# Altium schematic sheet cv_input.SchDoc
size A4; SheetNumber: 3; SheetTotal: 3
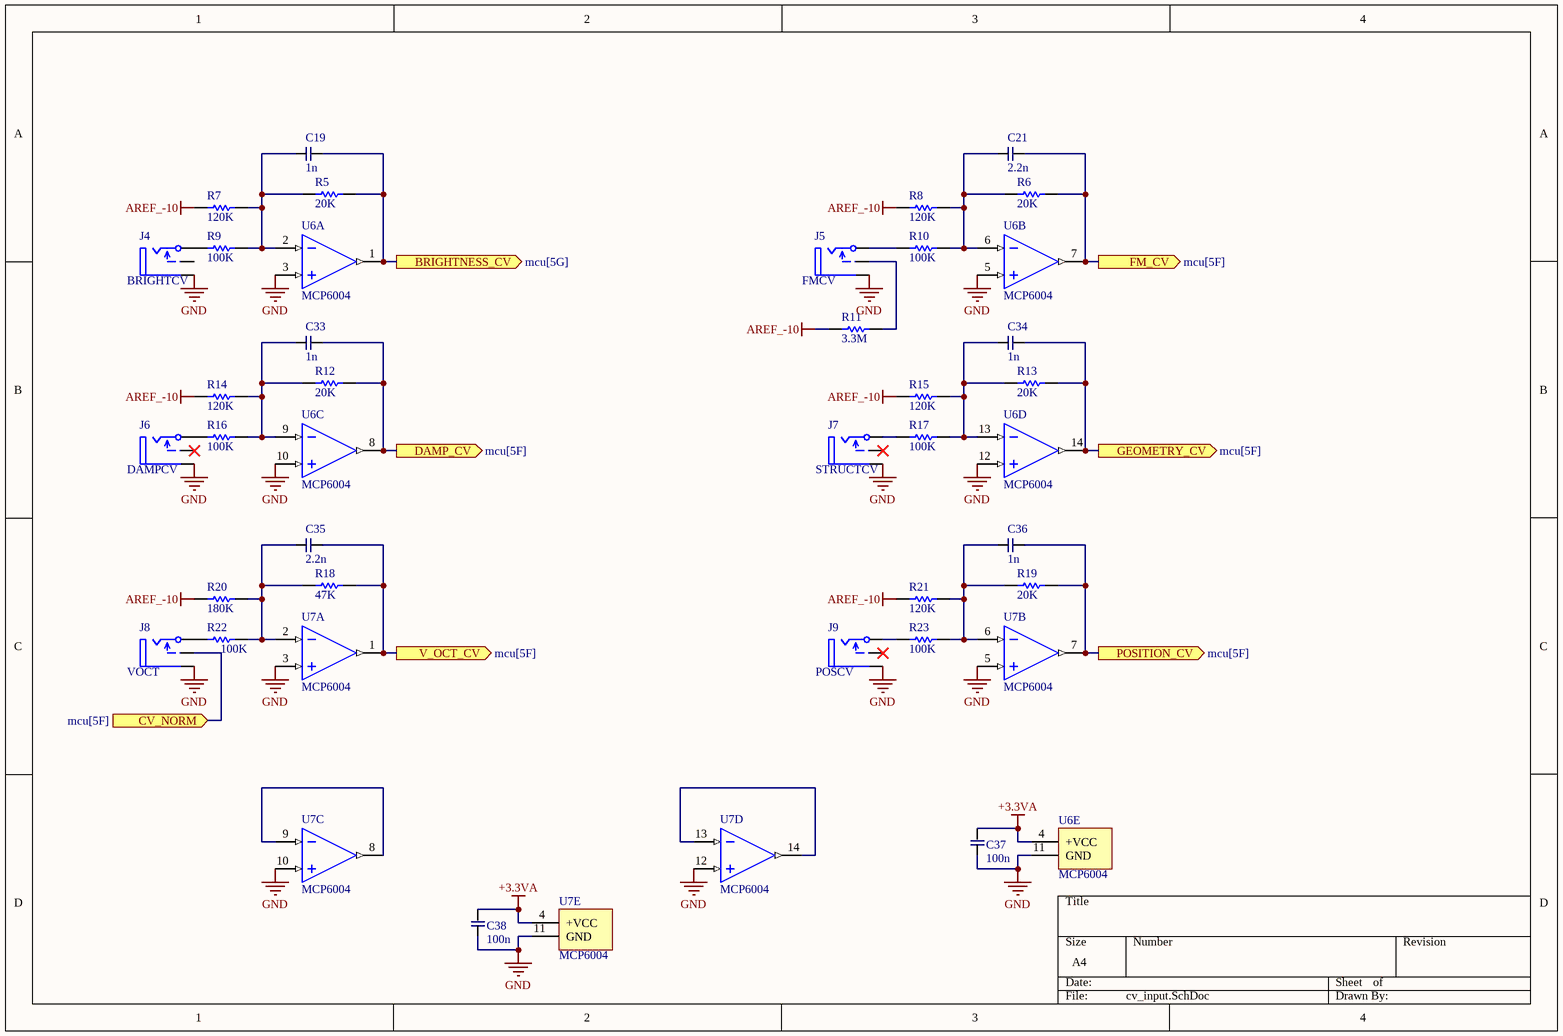
[diagram p0: cv_input.SchDoc]

## Parts
C19  value 1n  [C0603]  (hidden comment: Capacitor)
C21  value 2.2n  [C0603]  (hidden comment: Capacitor)
C33  value 1n  [C0603]  (hidden comment: Capacitor)
C34  value 1n  [C0603]  (hidden comment: Capacitor)
C35  value 2.2n  [C0603]  (hidden comment: Capacitor)
C36  value 1n  [C0603]  (hidden comment: Capacitor)
C37  value 100n  [C0603]  (hidden comment: Capacitor)
C38  value 100n  [C0603]  (hidden comment: Capacitor)
J4  BRIGHTCV  [PJ301_thonk]
J5  FMCV  [PJ301_thonk]
J6  DAMPCV  [PJ301_thonk]
J7  STRUCTCV  [PJ301_thonk]
J8  VOCT  [PJ301_thonk]
J9  POSCV  [PJ301_thonk]
R5  value 20K  [R0603]  (hidden comment: RESISTOR)
R6  value 20K  [R0603]  (hidden comment: RESISTOR)
R7  value 120K  [R0603]  (hidden comment: RESISTOR)
R8  value 120K  [R0603]  (hidden comment: RESISTOR)
R9  value 100K  [R0603]  (hidden comment: RESISTOR)
R10  value 100K  [R0603]  (hidden comment: RESISTOR)
R11  value 3.3M  [R0603]  (hidden comment: RESISTOR)
R12  value 20K  [R0603]  (hidden comment: RESISTOR)
R13  value 20K  [R0603]  (hidden comment: RESISTOR)
R14  value 120K  [R0603]  (hidden comment: RESISTOR)
R15  value 120K  [R0603]  (hidden comment: RESISTOR)
R16  value 100K  [R0603]  (hidden comment: RESISTOR)
R17  value 100K  [R0603]  (hidden comment: RESISTOR)
R18  value 47K  [R0603]  (hidden comment: RESISTOR)
R19  value 20K  [R0603]  (hidden comment: RESISTOR)
R20  value 180K  [R0603]  (hidden comment: RESISTOR)
R21  value 120K  [R0603]  (hidden comment: RESISTOR)
R22  value 100K  [R0603]  (hidden comment: RESISTOR)
R23  value 100K  [R0603]  (hidden comment: RESISTOR)
U6  MCP6004  [SOP14_L]  (parts A,B,C,D,E of 5)
U7  MCP6004  [SOP14_L]  (parts A,B,C,D,E of 5)

## Ports
BRIGHTNESS_CV (out, see mcu[5G]), CV_NORM (in, see mcu[5F]), DAMP_CV (out, see mcu[5F]), FM_CV (out, see mcu[5F]), GEOMETRY_CV (out, see mcu[5F]), POSITION_CV (out, see mcu[5F]), V_OCT_CV (out, see mcu[5F])

## Nets
+3.3VA: C37.2 C38.2 U6.4(+VCC) U7.4(+VCC)
AREF_-10: R7.1 R8.1 R11.1 R14.1 R15.1 R20.1 R21.1
GND: C37.1 C38.1 J4.1(Ground) J5.1(Ground) J6.1(Ground) J7.1(Ground) J8.1(Ground) J9.1(Ground) U6.3(IN1+) U6.5(IN2+) U6.10(IN3+) U6.11(GND) U6.12(IN4+) U7.3(IN1+) U7.5(IN2+) U7.10(IN3+) U7.11(GND) U7.12(IN4+)
BRIGHTNESS_CV: C19.2 R5.2 U6.1(OUT1) ; port BRIGHTNESS_CV
CV_NORM: J8.2(R_Radio_ch) ; port CV_NORM
DAMP_CV: C33.2 R12.2 U6.8(OUT3) ; port DAMP_CV
FM_CV: C21.2 R6.2 U6.7(OUT2) ; port FM_CV
GEOMETRY_CV: C34.2 R13.2 U6.14(OUT4) ; port GEOMETRY_CV
POSITION_CV: C36.2 R19.2 U7.7(OUT2) ; port POSITION_CV
V_OCT_CV: C35.2 R18.2 U7.1(OUT1) ; port V_OCT_CV
NetC19_1: C19.1 R5.1 R7.2 R9.2 U6.2(IN1-)
NetC21_1: C21.1 R6.1 R8.2 R10.2 U6.6(IN2-)
NetC33_1: C33.1 R12.1 R14.2 R16.2 U6.9(IN3-)
NetC34_1: C34.1 R13.1 R15.2 R17.2 U6.13(IN4-)
NetC35_1: C35.1 R18.1 R20.2 R22.2 U7.2(IN1-)
NetC36_1: C36.1 R19.1 R21.2 R23.2 U7.6(IN2-)
NetJ4_3: J4.3(R_Aux_in) R9.1
NetJ5_2: J5.2(R_Radio_ch) R11.2
NetJ5_3: J5.3(R_Aux_in) R10.1
NetJ6_3: J6.3(R_Aux_in) R16.1
NetJ7_3: J7.3(R_Aux_in) R17.1
NetJ8_3: J8.3(R_Aux_in) R22.1
NetJ9_3: J9.3(R_Aux_in) R23.1
NetU7_8: U7.8(OUT3) U7.9(IN3-)
NetU7_13: U7.13(IN4-) U7.14(OUT4)

Not connected (* = marked no-connect by the designer): J4 2(R_Radio_ch); J6 2(R_Radio_ch)*; J7 2(R_Radio_ch)*; J9 2(R_Radio_ch)*

## Library data of the parts
C19 C21 C33-C38 = Capacitor: Capacitor (Semiconductor SIM Model); Published: 8-Jun-2000; LatestRevisionDate: 29-May-2009; LatestRevisionNote: IPC-7351 Footprint Added.; PackageReference: C1206; Publisher: Altium Limited; PackageDescription: Chip Capacitor
J4-J9 = Audio_jack_mono: Value: Audio_jack_mono
U6 U7 = MCP6004: Rail-to-Rail Input/Output, 10 MHz Op Amps; Manufacturer: Texas Instruments; PartNumber: TL074CN; CMRR(Min)(dB): 70; Eco-Plan: Pb-Free (RoHS); GBW(Typ)(MHz): 3; IIB(Max)(pA): 200; Iq per channel(Max)(mA): 2.5; Number of Channels: 4; Offset Drift(Typ)(uV/C): 18; Rating: Military; Slew Rate(Typ)(V/us): 13; Sub Family: General Purpose Amplifier, High Supply Voltage Amplifier (>=30V); Total Supply Voltage(Max)(+5V is 5, +/-5V is 10): 36; Total Supply Voltage(Min)(+5V is 5, +/-5V is 10): 7; Vio (25C)(Max)(mV): 10; DatasheetVersion: SLOS080J; PackageVersion: 4040049/E, 12/2002; PackageReference: N14; PackageDescription: 14-Pin Plastic In-Line, Body 19.305 x 6.35 mm, Pitch 2.54 mm; Supplier 1: Digi-Key; Supplier Part Number 1: 296-1777-5-ND; Supplier 2: Newark; Supplier Part Number 2: 60K6990; Supplier 3: Mouser; Supplier Part Number 3: 595-TL074CN; Vn at 1kHz(Typ)(nV/rtHz): 18; Mounting Technology: Through Hole; Code_JEDEC: MS-001; Value: MCP6004; LCSC Part: C7378
R5-R23 = RESISTOR: Published: 8-Jun-2000; LatestRevisionDate: 17-Jul-2002; LatestRevisionNote: Re-released for DXP Platform.; PackageReference: AXIAL-0.3; Publisher: Altium Limited; PackageDescription: Axial Device, Thru-Hole; 2 Leads; 0.3 in Pin Spacing